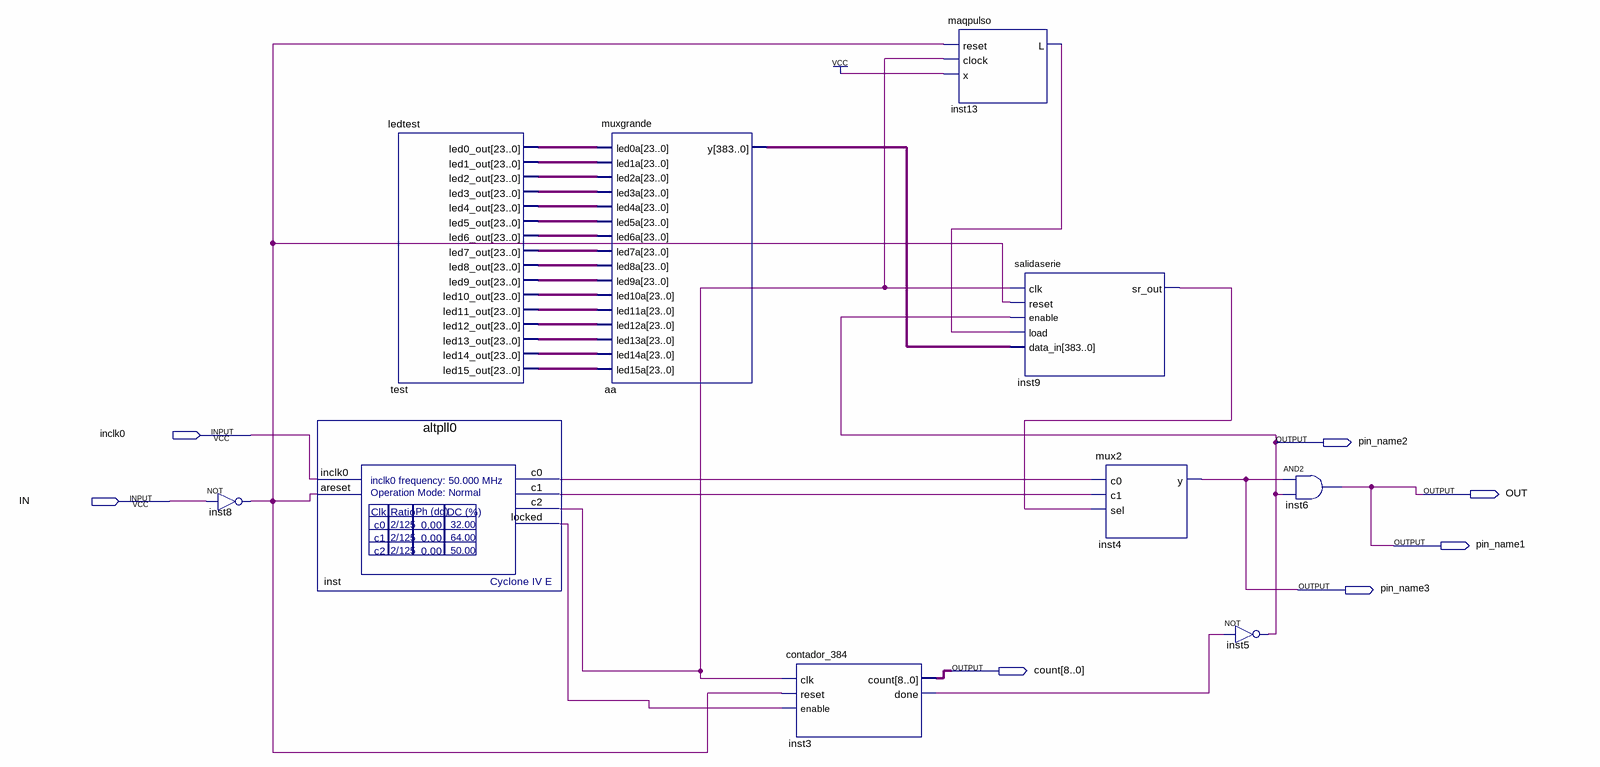
[diagram p0: schematic sheet]
// Quartus schematic Block1.bdf as structural Verilog: 10 symbols, 7 pins
module Block1 (
  input  inclk0,
  input  IN,
  output pin_name2,
  output OUT,
  output pin_name1,
  output pin_name3,
  output [8:0] count
);

  wire inst3_done, inst8_out, inst9_sr_out, inst13_l, inst_c0, inst_c1, inst_c2, inst_locked;
  wire [23:0] test_led0_out, test_led1_out, test_led2_out, test_led3_out, test_led4_out, test_led5_out,
       test_led6_out, test_led7_out, test_led8_out, test_led9_out, test_led10_out, test_led11_out,
       test_led12_out, test_led13_out, test_led14_out, test_led15_out;
  wire [383:0] aa_y;

  not inst8 (inst8_out, IN);
  altpll0 inst (.inclk0(inclk0), .areset(inst8_out), .c0(inst_c0), .c1(inst_c1), .c2(inst_c2), .locked(inst_locked));
  ledtest test (
    .led0_out(test_led0_out), .led1_out(test_led1_out), .led2_out(test_led2_out), .led3_out(test_led3_out),
    .led4_out(test_led4_out), .led5_out(test_led5_out), .led6_out(test_led6_out), .led7_out(test_led7_out),
    .led8_out(test_led8_out), .led9_out(test_led9_out), .led10_out(test_led10_out),
    .led11_out(test_led11_out), .led12_out(test_led12_out), .led13_out(test_led13_out),
    .led14_out(test_led14_out), .led15_out(test_led15_out));
  muxgrande aa (
    .led0a(test_led0_out), .led1a(test_led1_out), .led2a(test_led2_out), .led3a(test_led3_out),
    .led4a(test_led4_out), .led5a(test_led5_out), .led6a(test_led6_out), .led7a(test_led7_out),
    .led8a(test_led8_out), .led9a(test_led9_out), .led10a(test_led10_out), .led11a(test_led11_out),
    .led12a(test_led12_out), .led13a(test_led13_out), .led14a(test_led14_out), .led15a(test_led15_out),
    .y(aa_y));
  contador_384 inst3 (.clk(inst_c2), .reset(inst8_out), .enable(inst_locked), .count(count), .done(inst3_done));
  maqpulso inst13 (.reset(inst8_out), .clock(inst_c2), .x(1'b1), .L(inst13_l));
  salidaserie inst9 (
    .clk(inst_c2), .reset(inst8_out), .enable(pin_name2), .load(inst13_l), .data_in(aa_y),
    .sr_out(inst9_sr_out));
  mux2 inst4 (.c0(inst_c0), .c1(inst_c1), .sel(inst9_sr_out), .y(pin_name3));
  not inst5 (pin_name2, inst3_done);
  and inst6 (OUT, pin_name3, pin_name2);

  assign pin_name1 = OUT;
endmodule
